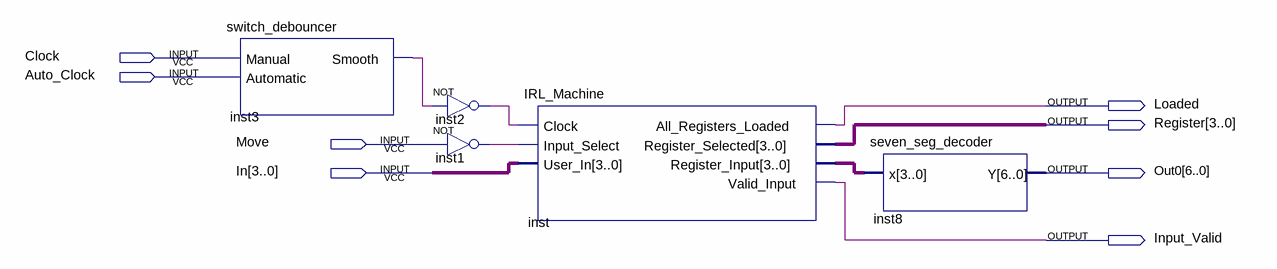
[diagram p0: schematic sheet]
// Quartus schematic IRL_Test.bdf as structural Verilog: 5 symbols, 8 pins
module IRL_Test (
  input  Clock,
  input  Auto_Clock,
  input  Move,
  input  [3:0] In,
  output Loaded,
  output [3:0] Register,
  output [6:0] Out0,
  output Input_Valid
);

  wire inst1_out, inst2_out, inst3_smooth;
  wire [3:0] inst_register_input;

  switch_debouncer inst3 (.Manual(Clock), .Automatic(Auto_Clock), .Smooth(inst3_smooth));
  not inst2 (inst2_out, inst3_smooth);
  not inst1 (inst1_out, Move);
  IRL_Machine inst (
    .Clock(inst2_out), .Input_Select(inst1_out), .User_In(In), .All_Registers_Loaded(Loaded),
    .Register_Selected(Register), .Register_Input(inst_register_input), .Valid_Input(Input_Valid));
  seven_seg_decoder inst8 (.x(inst_register_input), .Y(Out0));
endmodule
